# Altium schematic sheet SCH_8Relay.SchDoc
size A; SheetNumber: 1; SheetTotal: 1
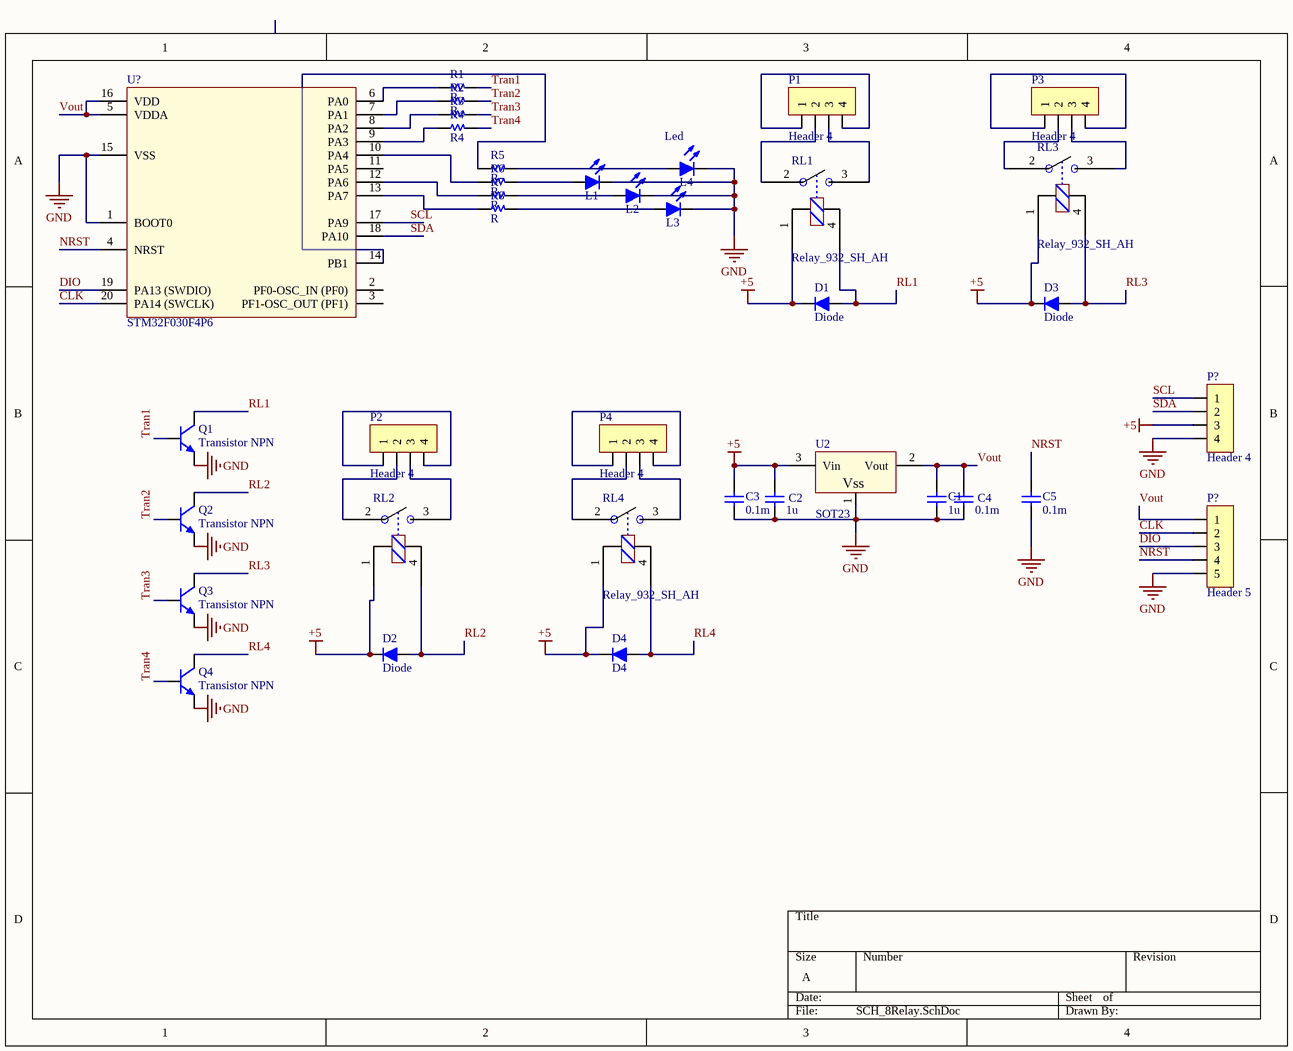
[diagram p0: SCH_8Relay.SchDoc]

## Parts
(Parts that share a designator on the sheet are numbered #1, #2 ... from top to bottom, then left to right.)
C1  1u  [C 0805]
C2  1u  [C 0805]
C3  0.1m  [C 0805]
C4  0.1m  [C 0805]
C5  0.1m  [C 0805]
D1  Diode  [DO-214AC (SMA)]
D2  Diode  [DO-214AC (SMA)]
D3  Diode  [DO-214AC (SMA)]
D4  D4  [DO-214AC (SMA)]
L1  Led  [Led 0805]  (value not drawn)
L2  Led  [Led 0805]  (value not drawn)
L3  Led  [Led 0805]  (value not drawn)
L4  Led  [Led 0805]
P1  Header 4  [HDR/Terminal/4/RA]
P2  Header 4  [HDR/Terminal/4/RA]
P3  Header 4  [HDR/Terminal/4/RA]
P4  Header 4  [HDR/Terminal/4/RA]
P?#1  Header 4  [HDR/Header/4/2mm/BOX/RA]
P?#2  Header 5  [HDR/Header/5/2mm]
Q1  Transistor NPN  [SOT-23]
Q2  Transistor NPN  [SOT-23]
Q3  Transistor NPN  [SOT-23]
Q4  Transistor NPN  [SOT-23]
R1  R  [R 0805]
R2  R  [R 0805]
R3  (no value)  [R 0805]
R4  R4  [R 0805]
R5  R  [R 0805]
R6  R  [R 0805]
R7  R  [R 0805]
R8  R  [R 0805]
RL1  Relay_932_SH_AH  [RELAY932]
RL2  (no value)  [RELAY932]
RL3  Relay_932_SH_AH  [RELAY932]
RL4  Relay_932_SH_AH  [RELAY932]
U2  SOT23  [SOT-23]
U?  STM32F030F4P6  [ST/TSSOP20]

## Nets
+5: C2.1 C3.1 D1.2(K) D2.2(K) D3.2(K) D4.2(K) P?#1.3 RL1.1 RL2.1 RL3.1 RL4.1 U2.3(Vin)
GND: C1.2 C2.2 C3.2 C4.2 C5.1 L1.2(K) L2.2(K) L3.2(K) L4.2(K) P?#1.4 P?#2.5 Q1.2(E) Q2.2(E) Q3.2(E) Q4.2(E) U2.1(VSS) U?.1(BOOT0) U?.15(VSS)
CLK: P?#2.2 U?.20(PA14_(SWCLK))
DIO: P?#2.3 U?.19(PA13_(SWDIO))
NRST: C5.2 P?#2.4 U?.4(NRST)
RL1: D1.1(A) Q1.3(C) RL1.4
RL2: D2.1(A) Q2.3(C) RL2.4
RL3: D3.1(A) Q3.3(C) RL3.4
RL4: D4.1(A) Q4.3(C) RL4.4
SCL: P?#1.1 U?.17(PA9)
SDA: P?#1.2 U?.18(PA10)
Tran1: Q1.1(B) R1.2
Tran2: Q2.1(B) R2.2
Tran3: Q3.1(B) R3.2
Tran4: Q4.1(B) R4.2
Vout: C1.1 C4.1 P?#2.1 U2.2(Vout) U?.5(VDDA) U?.16(VDD)
NetL1_1: L1.1(A) R6.2
NetL2_1: L2.1(A) R7.2
NetL3_1: L3.1(A) R8.2
NetL4_1: L4.1(A) R5.2
NetP1_1: P1.1 P1.4
NetP1_2: P1.2 RL1.2
NetP1_3: P1.3 RL1.3
NetP2_1: P2.1 P2.4
NetP2_2: P2.2 RL2.2
NetP2_3: P2.3 RL2.3
NetP3_1: P3.1 P3.4
NetP3_2: P3.2 RL3.2
NetP3_3: P3.3 RL3.3
NetP4_1: P4.1 P4.4
NetP4_2: P4.2 RL4.2
NetP4_3: P4.3 RL4.3
NetR1_1: R1.1 U?.6(PA0)
NetR2_1: R2.1 U?.7(PA1)
NetR3_1: R3.1 U?.8(PA2)
NetR4_1: R4.1 U?.9(PA3)
NetR5_1: R5.1 U?.14(PB1)
NetR6_1: R6.1 U?.10(PA4)
NetR7_1: R7.1 U?.12(PA6)
NetR8_1: R8.1 U?.13(PA7)

Not connected (* = marked no-connect by the designer): U? 2(PF0-OSC_IN_(PF0)) 3(PF1-OSC_OUT_(PF1)) 11(PA5)

## Notes on the sheet
- (in symbol XC6206P332MR-G) Vss

## Library data of the parts
C1-C5 = Capacitor NP: Capacitor non-pol
D1-D4 = Diode: Default Diode
L1-L4 = Led: Typical LED
P1-P4 P?#1 = Header 4: Header, 4-Pin
P?#2 = Header 5: Header, 5-Pin
Q1-Q4 = Transistor NPN: NPN Bipolar Transistor
R1-R8 = Resistor
RL2 = Relay_932_SH_AH
U2 = XC6206P332MR-G: LDO Voltage Regulators 1uA Low Quiescent 3 Terminal, Low ESR Cap. Compatible, Voltage Regulator; Brand: Torex Semiconductor; Package: SOT-23-3; Type: SMD
U? = STM32F030F4P6: IC MCU 32BIT 16KB FLASH 20TSSOP; Manufacturer: STMicroelectronics; Core Processor: ARM® Cortex®-M0; Core Size: 32-Bit; Speed: 48MHz; Connectivity: I²C, SPI, UART/USART; Peripherals: DMA, POR, PWM, WDT; Program Memory Size: 16KB (16K x 8); RAM Size: 4K x 8; Voltage - Supply (Vcc/Vdd): 2.4 V ~ 3.6 V; Data Converters: A/D 11x12b; Oscillator Type: Internal; Supplier 1: Digi-Key; Supplier Part Number 1: 497-14044-5-ND; Manufacturer Part Number: STM32F030F4P6; RoHS: RoHS Compliant; Category: Integrated Circuits (ICs); Stock 1: 8559; Pricing 1: 1=1.3, 74=1.10122, 148=0.90459, 518=0.74728, 1036=0.58995 (USD); Packaging: Tube; Part Status: Active; Program Memory Type: FLASH; EEPROM Size: -; Operating Temperature: -40°C ~ 85°C (TA); Base Part Number: STM32F030; ComponentLink1URL: http://www.st.com/content/ccc/resource/technical/document/datasheet/a4/5d/0b/0e/87/c4/4d/71/DM00088500.pdf/files/DM00088500.pdf/jcr:content/translations/en.DM00088500.pdf; ComponentLink1Description: http://www.st.com/content/ccc/resource/technical/document/datasheet/a4/5d/0b/0e/87/c4/4d/71/DM00088500.pdf/files/DM00088500.pdf/jcr:content/translations/en.DM00088500.pdf; Package: 20-TSSOP (0.173", 4.40mm Width)